# EAGLE schematic switching-psu (EAGLE 9.6.1)
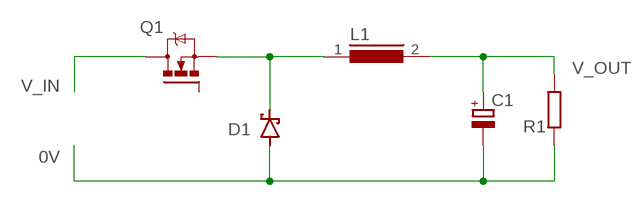
[diagram p0: schematic, sheet 1]

## Parts
C1  CPOL-EUE7.5-18  [E7,5-18]
D1  1N5819-B  [DO41-7.6]
L1  A26GFC  [A26GFC]
Q1  IRFZ48Z  [TO220BH]
R1  R-EU_0207/10  [0207/10]

## Nets
0V: C1.- D1.A R1.1
N$1: D1.C L1.1 Q1.S
V_IN: Q1.D
V_OUT: C1.+ L1.2 R1.2
Unconnected: Q1.G

## Library data of the parts
C1 = rcl:CPOL-EU: POLARIZED CAPACITOR, European symbol; SPICEPREFIX: C
D1 = diode:1N581*: 1.0A SCHOTTKY BARRIER RECTIFIER Source: http://www.diodes.com/datasheets/ds23001.pdf
L1 = inductors:A26GFC: INDUCTOR; SPICEPREFIX: L
Q1 = transistor-power:IRFZ48: N Channel HEXFET® Power MOSFET Logic Level Source: http://www.irf.com/product-info/datasheets/data/irfz48z.pdf
R1 = rcl:R-EU_: RESISTOR, European symbol; SPICEPREFIX: R